# EAGLE design DSKY_DISP (EAGLE 7.4.0)
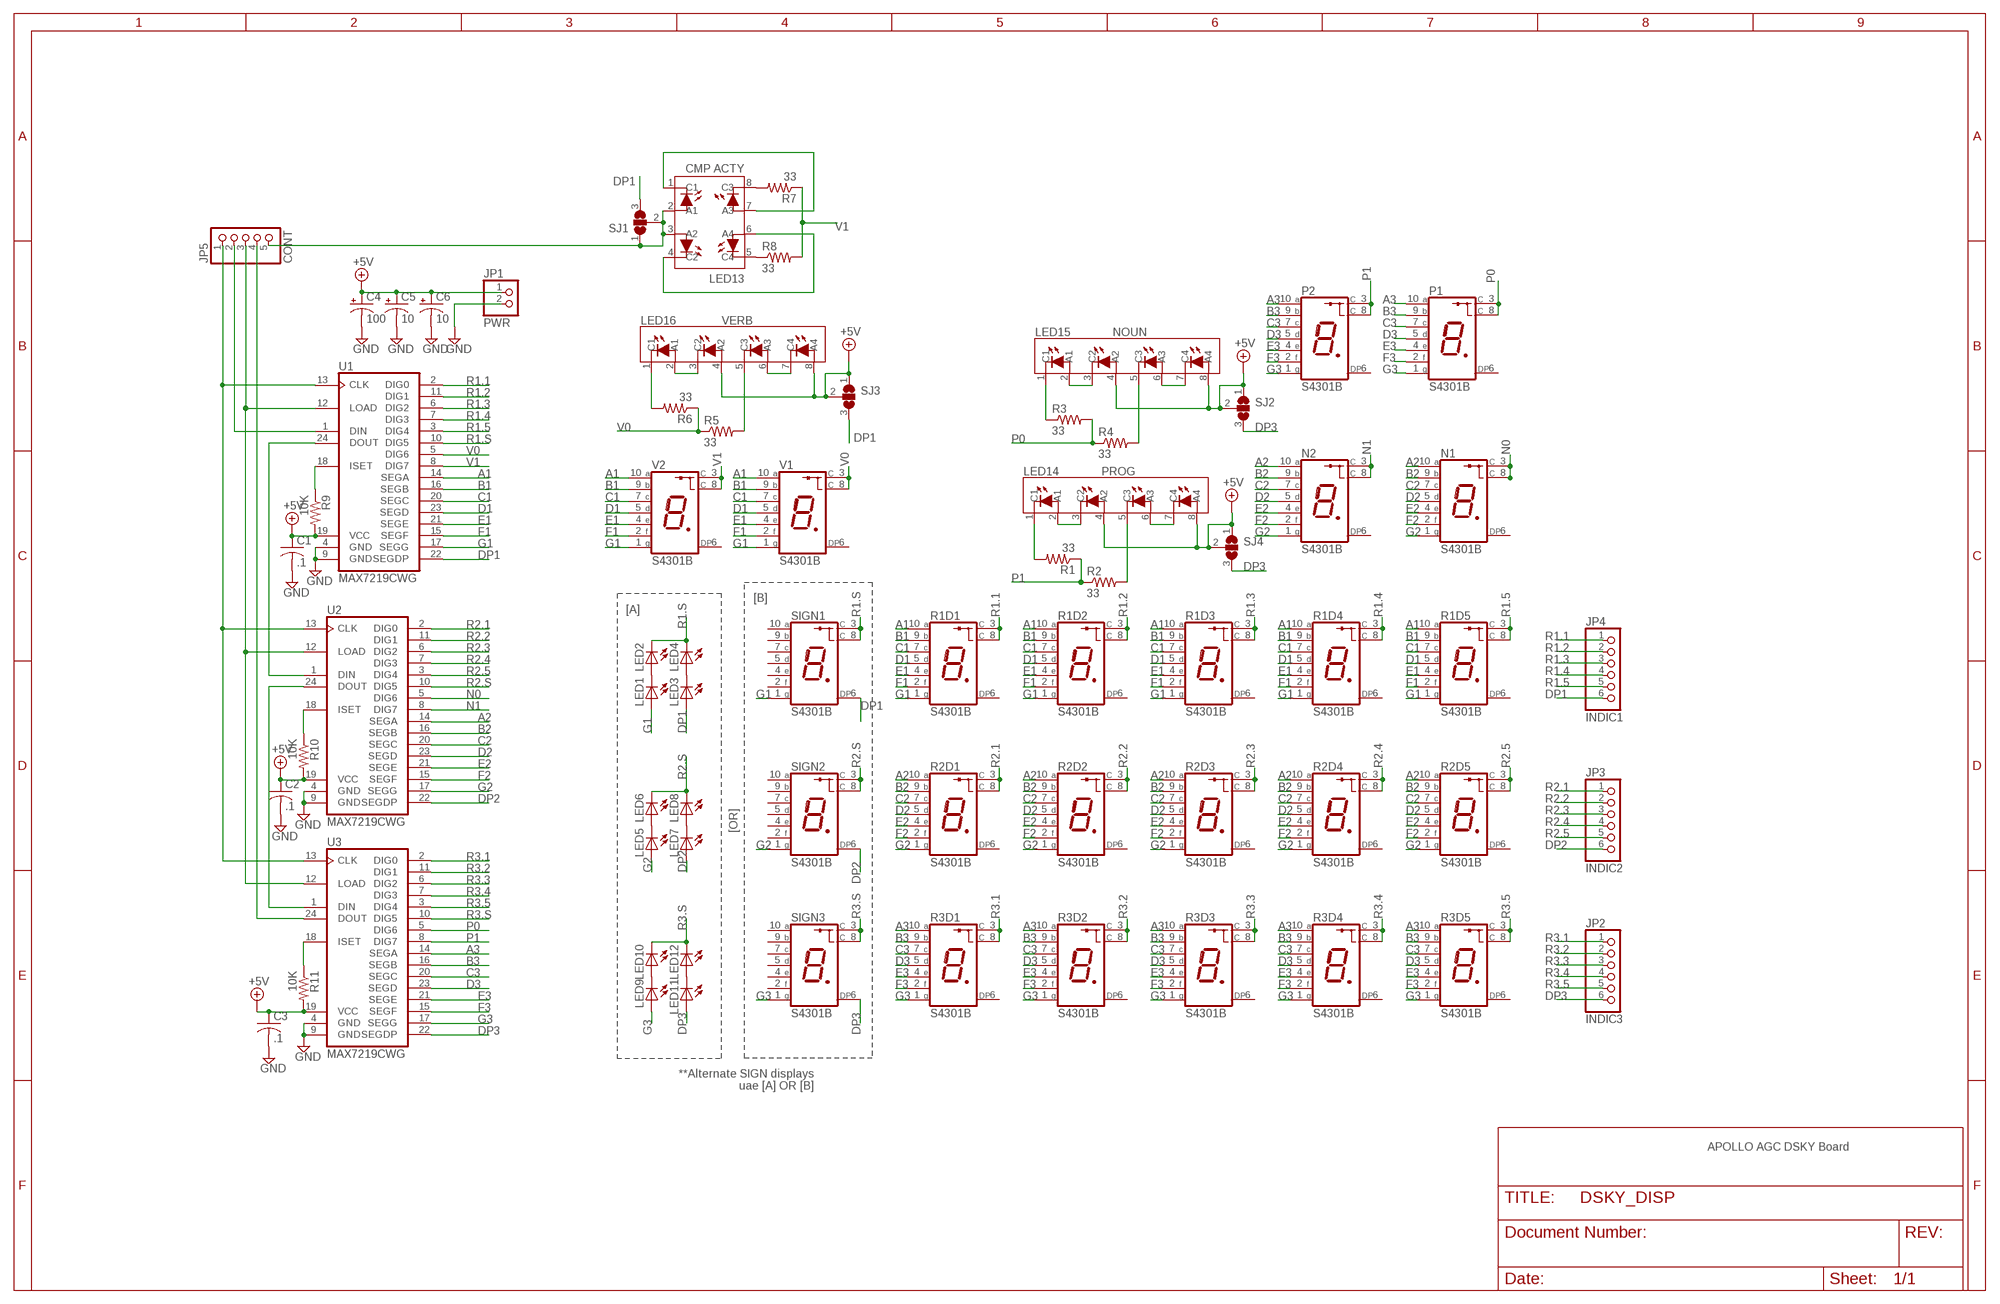
[diagram p0: schematic, sheet 1]

## Parts
C1  .1  C-US025-030X050  [C025-030X050]
C2  .1  C-US025-030X050  [C025-030X050]
C3  .1  C-US025-030X050  [C025-030X050]
C4  100  CPOL-USE2,5-6E  [E2,5-6E]
C5  10  CPOL-USE1.8-4  [E1,8-4]
C6  10  CPOL-USE1.8-4  [E1,8-4]
JP1  PWR  PINHD-1X2  [1X02]
JP2  INDIC3  PINHD-1X6  [1X06]
JP3  INDIC2  PINHD-1X6  [1X06]
JP4  INDIC1  PINHD-1X6  [1X06]
JP5  CONT  PINHD-1X5  [1X05]
LED1  LEDCHIPLED_0603  [CHIPLED_0603]
LED2  LEDCHIPLED_0603  [CHIPLED_0603]
LED3  LEDCHIPLED_0603  [CHIPLED_0603]
LED4  LEDCHIPLED_0603  [CHIPLED_0603]
LED5  LEDCHIPLED_0603  [CHIPLED_0603]
LED6  LEDCHIPLED_0603  [CHIPLED_0603]
LED7  LEDCHIPLED_0603  [CHIPLED_0603]
LED8  LEDCHIPLED_0603  [CHIPLED_0603]
LED9  LEDCHIPLED_0603  [CHIPLED_0603]
LED10  LEDCHIPLED_0603  [CHIPLED_0603]
LED11  LEDCHIPLED_0603  [CHIPLED_0603]
LED12  LEDCHIPLED_0603  [CHIPLED_0603]
LED13  CMP ACTY  HCLP-HLMP-2855  [SOCKET-08]
LED14  PROG  HLMP-2655  [SIP-08]
LED15  NOUN  HLMP-2655  [SIP-08]
LED16  VERB  HLMP-2655  [SIP-08]
N1  S4301B  [S4301B]
N2  S4301B  [S4301B]
P1  S4301B  [S4301B]
P2  S4301B  [S4301B]
R1  33  R-US_0207/10  [0207/10]
R1D1  S4301B  [S4301B]
R1D2  S4301B  [S4301B]
R1D3  S4301B  [S4301B]
R1D4  S4301B  [S4301B]
R1D5  S4301B  [S4301B]
R2  33  R-US_0207/10  [0207/10]
R2D1  S4301B  [S4301B]
R2D2  S4301B  [S4301B]
R2D3  S4301B  [S4301B]
R2D4  S4301B  [S4301B]
R2D5  S4301B  [S4301B]
R3  33  R-US_0207/10  [0207/10]
R3D1  S4301B  [S4301B]
R3D2  S4301B  [S4301B]
R3D3  S4301B  [S4301B]
R3D4  S4301B  [S4301B]
R3D5  S4301B  [S4301B]
R4  33  R-US_0207/10  [0207/10]
R5  33  R-US_0207/10  [0207/10]
R6  33  R-US_0207/10  [0207/10]
R7  33  R-US_0207/10  [0207/10]
R8  33  R-US_0207/10  [0207/10]
R9  10K  R-US_0207/10  [0207/10]
R10  10K  R-US_0207/10  [0207/10]
R11  10K  R-US_0207/10  [0207/10]
SIGN1  S4301B  [S4301B]
SIGN2  S4301B  [S4301B]
SIGN3  S4301B  [S4301B]
SJ1  SJ2WW  [SJ_2W]
SJ2  SJ2WW  [SJ_2W]
SJ3  SJ2WW  [SJ_2W]
SJ4  SJ2WW  [SJ_2W]
U1  MAX7219CWG  [SO24W]
U2  MAX7219CWG  [SO24W]
U3  MAX7219CWG  [SO24W]
V1  S4301B  [S4301B]
V2  S4301B  [S4301B]

## Nets
+5V: C1.1 C2.1 C3.1 C4.+ C5.+ C6.+ JP1.1 LED14.4(A2) LED14.8(A4) LED15.4(A2) LED15.8(A4) LED16.4(A2) LED16.8(A4) R9.2 R10.2 R11.2 SJ2.1 SJ2.2 SJ3.1 SJ3.2 SJ4.1 SJ4.2 U1.19(VCC) U2.19(VCC) U3.19(VCC)
A1: R1D1.10(A) R1D2.10(A) R1D3.10(A) R1D4.10(A) R1D5.10(A) U1.14(SEGA) V1.10(A) V2.10(A)
A2: N1.10(A) N2.10(A) R2D1.10(A) R2D2.10(A) R2D3.10(A) R2D4.10(A) R2D5.10(A) U2.14(SEGA)
A3: P1.10(A) P2.10(A) R3D1.10(A) R3D2.10(A) R3D3.10(A) R3D4.10(A) R3D5.10(A) U3.14(SEGA)
B1: R1D1.9(B) R1D2.9(B) R1D3.9(B) R1D4.9(B) R1D5.9(B) U1.16(SEGB) V1.9(B) V2.9(B)
B2: N1.9(B) N2.9(B) R2D1.9(B) R2D2.9(B) R2D3.9(B) R2D4.9(B) R2D5.9(B) U2.16(SEGB)
B3: P1.9(B) P2.9(B) R3D1.9(B) R3D2.9(B) R3D3.9(B) R3D4.9(B) R3D5.9(B) U3.16(SEGB)
C1: R1D1.7(C) R1D2.7(C) R1D3.7(C) R1D4.7(C) R1D5.7(C) U1.20(SEGC) V1.7(C) V2.7(C)
C2: N1.7(C) N2.7(C) R2D1.7(C) R2D2.7(C) R2D3.7(C) R2D4.7(C) R2D5.7(C) U2.20(SEGC)
C3: P1.7(C) P2.7(C) R3D1.7(C) R3D2.7(C) R3D3.7(C) R3D4.7(C) R3D5.7(C) U3.20(SEGC)
D1: R1D1.5(D) R1D2.5(D) R1D3.5(D) R1D4.5(D) R1D5.5(D) U1.23(SEGD) V1.5(D) V2.5(D)
D2: N1.5(D) N2.5(D) R2D1.5(D) R2D2.5(D) R2D3.5(D) R2D4.5(D) R2D5.5(D) U2.23(SEGD)
D3: P1.5(D) P2.5(D) R3D1.5(D) R3D2.5(D) R3D3.5(D) R3D4.5(D) R3D5.5(D) U3.23(SEGD)
DP1: JP4.6 LED3.A SIGN1.6(DP) SJ1.3 SJ3.3 U1.22(SEGDP)
DP2: JP3.6 LED7.A SIGN2.6(DP) U2.22(SEGDP)
DP3: JP2.6 LED11.A SIGN3.6(DP) SJ2.3 SJ4.3 U3.22(SEGDP)
E1: R1D1.4(E) R1D2.4(E) R1D3.4(E) R1D4.4(E) R1D5.4(E) U1.21(SEGE) V1.4(E) V2.4(E)
E2: N1.4(E) N2.4(E) R2D1.4(E) R2D2.4(E) R2D3.4(E) R2D4.4(E) R2D5.4(E) U2.21(SEGE)
E3: P1.4(E) P2.4(E) R3D1.4(E) R3D2.4(E) R3D3.4(E) R3D4.4(E) R3D5.4(E) U3.21(SEGE)
F1: R1D1.2(F) R1D2.2(F) R1D3.2(F) R1D4.2(F) R1D5.2(F) U1.15(SEGF) V1.2(F) V2.2(F)
F2: N1.2(F) N2.2(F) R2D1.2(F) R2D2.2(F) R2D3.2(F) R2D4.2(F) R2D5.2(F) U2.15(SEGF)
F3: P1.2(F) P2.2(F) R3D1.2(F) R3D2.2(F) R3D3.2(F) R3D4.2(F) R3D5.2(F) U3.15(SEGF)
G1: LED1.A R1D1.1(G) R1D2.1(G) R1D3.1(G) R1D4.1(G) R1D5.1(G) SIGN1.1(G) U1.17(SEGG) V1.1(G) V2.1(G)
G2: LED5.A N1.1(G) N2.1(G) R2D1.1(G) R2D2.1(G) R2D3.1(G) R2D4.1(G) R2D5.1(G) SIGN2.1(G) U2.17(SEGG)
G3: LED9.A P1.1(G) P2.1(G) R3D1.1(G) R3D2.1(G) R3D3.1(G) R3D4.1(G) R3D5.1(G) SIGN3.1(G) U3.17(SEGG)
GND: C1.2 C2.2 C3.2 C4.- C5.- C6.- JP1.2 U1.4(GND) U1.9(GND) U2.4(GND) U2.9(GND) U3.4(GND) U3.9(GND)
N0: N1.3(C) N1.8(C) U2.5(DIG6)
N1: N2.3(C) N2.8(C) U2.8(DIG7)
N$1: LED1.C LED2.A
N$2: LED3.C LED4.A
N$3: LED5.C LED6.A
N$4: LED7.C LED8.A
N$5: LED11.C LED12.A
N$6: LED9.C LED10.A
N$7: LED14.6(A3) LED14.7(C4)
N$8: LED14.2(A1) LED14.3(C2)
N$9: LED15.6(A3) LED15.7(C4)
N$10: LED15.2(A1) LED15.3(C2)
N$11: LED16.6(A3) LED16.7(C4)
N$12: LED16.2(A1) LED16.3(C2)
N$14: LED13.1(C1) LED13.7(A3)
N$15: LED13.4(C2) LED13.6(A4)
N$16: LED14.1(C1) R1.2
N$17: LED14.5(C3) R2.2
N$18: LED13.8(C3) R7.2
N$19: LED15.1(C1) R3.1
N$20: LED15.5(C3) R4.2
N$21: LED13.5(C4) R8.1
N$22: LED16.5(C3) R5.2
N$23: LED16.1(C1) R6.2
N$24: JP5.2 U1.1(DIN)
N$25: U1.24(DOUT) U2.1(DIN)
N$27: U2.24(DOUT) U3.1(DIN)
N$28: JP5.3 U1.12(LOAD) U2.12(LOAD) U3.12(LOAD)
N$29: JP5.1 U1.13(CLK) U2.13(CLK) U3.13(CLK)
N$31: JP5.4 U3.24(DOUT)
N$34: R9.1 U1.18(ISET)
N$35: R10.1 U2.18(ISET)
N$36: R11.1 U3.18(ISET)
N$37: JP5.5 LED13.2(A1) LED13.3(A2) SJ1.1 SJ1.2
P0: P1.3(C) P1.8(C) R3.2 R4.1 U3.5(DIG6)
P1: P2.3(C) P2.8(C) R1.1 R2.1 U3.8(DIG7)
R1.1: JP4.1 R1D1.3(C) R1D1.8(C) U1.2(DIG0)
R1.2: JP4.2 R1D2.3(C) R1D2.8(C) U1.11(DIG1)
R1.3: JP4.3 R1D3.3(C) R1D3.8(C) U1.6(DIG2)
R1.4: JP4.4 R1D4.3(C) R1D4.8(C) U1.7(DIG3)
R1.5: JP4.5 R1D5.3(C) R1D5.8(C) U1.3(DIG4)
R1.S: LED2.C LED4.C SIGN1.3(C) SIGN1.8(C) U1.10(DIG5)
R2.1: JP3.1 R2D1.3(C) R2D1.8(C) U2.2(DIG0)
R2.2: JP3.2 R2D2.3(C) R2D2.8(C) U2.11(DIG1)
R2.3: JP3.3 R2D3.3(C) R2D3.8(C) U2.6(DIG2)
R2.4: JP3.4 R2D4.3(C) R2D4.8(C) U2.7(DIG3)
R2.5: JP3.5 R2D5.3(C) R2D5.8(C) U2.3(DIG4)
R2.S: LED6.C LED8.C SIGN2.3(C) SIGN2.8(C) U2.10(DIG5)
R3.1: JP2.1 R3D1.3(C) R3D1.8(C) U3.2(DIG0)
R3.2: JP2.2 R3D2.3(C) R3D2.8(C) U3.11(DIG1)
R3.3: JP2.3 R3D3.3(C) R3D3.8(C) U3.6(DIG2)
R3.4: JP2.4 R3D4.3(C) R3D4.8(C) U3.7(DIG3)
R3.5: JP2.5 R3D5.3(C) R3D5.8(C) U3.3(DIG4)
R3.S: LED10.C LED12.C SIGN3.3(C) SIGN3.8(C) U3.10(DIG5)
V0: R5.1 R6.1 U1.5(DIG6) V1.3(C) V1.8(C)
V1: R7.1 R8.2 U1.8(DIG7) V2.3(C) V2.8(C)
Unconnected: N1.6(DP) N2.6(DP) P1.6(DP) P2.6(DP) R1D1.6(DP) R1D2.6(DP) R1D3.6(DP) R1D4.6(DP) R1D5.6(DP) R2D1.6(DP) R2D2.6(DP) R2D3.6(DP) R2D4.6(DP) R2D5.6(DP) R3D1.6(DP) R3D2.6(DP) R3D3.6(DP) R3D4.6(DP) R3D5.6(DP) SIGN1.2(F) SIGN1.4(E) SIGN1.5(D) SIGN1.7(C) SIGN1.9(B) SIGN1.10(A) SIGN2.2(F) SIGN2.4(E) SIGN2.5(D) SIGN2.7(C) SIGN2.9(B) SIGN2.10(A) SIGN3.2(F) SIGN3.4(E) SIGN3.5(D) SIGN3.7(C) SIGN3.9(B) SIGN3.10(A) V1.6(DP) V2.6(DP)

## Notes on the sheet
- [B]
- [A]
- [OR]
- **Alternate SIGN displays
  uae [A] OR [B]
- APOLLO AGC DSKY Board

## Library data of the parts
C1-C3 = rcl:C-US: CAPACITOR, American symbol
C4-C6 = rcl:CPOL-US: POLARIZED CAPACITOR, American symbol
JP1 = pinhead:PINHD-1X2: PIN HEADER
JP2-JP4 = pinhead:PINHD-1X6: PIN HEADER
JP5 = pinhead:PINHD-1X5: PIN HEADER
LED1-LED12 = led:LED: LED OSRAM: - CHIPLED LG R971, LG N971, LY N971, LG Q971, LY Q971, LO R971, LY R971 LH N974, LH R974 LS Q976, LO Q976, LY Q976 LO Q996 - Hyper CHIPLED LW Q18S LB Q993, LB Q99A, LB R99A - SideLED LS A670, LO A670, LY A670, LG A670, LP A670 LB A673, LV A673, LT A673, LW A673 LH A674 LY A675 LS A676, LA A676, LO A676, LY A676, LW A676 LS A679, LY A679, LG A679 - Hyper Micro SIDELED® LS Y876, LA Y876, LO Y876, LY Y876 LT Y87S - SmartLED LW L88C, LW L88S LB L89C, LB L89S, LG L890 LS L89K, LO L89K, LY L89K LS L896, LA L896, LO L896, LY L896 - TOPLED LS T670, LO T670, LY T670, LG T670, LP T670 LSG T670, LSP T670, LSY T670, LOP T670, LYG T670 LG T671, LOG T671, LSG T671 LB T673, LV T673, LT T673, LW T673 LH T674 LS T676, LA T676, LO T676, LY T676, LB T676, LH T676, LSB T676, LW T676 LB T67C, LV T67C, LT T67C, LS T67K, LO T67K, LY T67K, LW E67C LS E67B, LA E67B, LO E67B, LY E67B, LB E67C, LV E67C, LT E67C LW T67C LS T679, LY T679, LG T679 LS T770, LO T770, LY T770, LG T770, LP T770 LB T773, LV T773, LT T773, LW T773 LH T774 LS E675, LA E675, LY E675, LS T675 LS T776, LA T776, LO T776, LY T776, LB T776 LHGB T686 LT T68C, LB T68C - Hyper Mini TOPLED® LB M676 - Mini TOPLED Santana® LG M470 LS M47K, LO M47K, LY M47K Source: http://www.osram.convergy.de LUXEON: - LUMILED® LXK2-PW12-R00, LXK2-PW12-S00, LXK2-PW14-U00, LXK2-PW14-V00 LXK2-PM12-R00, LXK2-PM12-S00, LXK2-PM14-U00 LXK2-PE12-Q00, LXK2-PE12-R00, LXK2-PE12-S00, LXK2-PE14-T00, LXK2-PE14-U00 LXK2-PB12-K00, LXK2-PB12-L00, LXK2-PB12-M00, LXK2-PB14-N00, LXK2-PB14-P00, LXK2-PB14-Q00 LXK2-PR12-L00, LXK2-PR12-M00, LXK2-PR14-Q00, LXK2-PR14-R00 LXK2-PD12-Q00, LXK2-PD12-R00, LXK2-PD12-S00 LXK2-PH12-R00, LXK2-PH12-S00 LXK2-PL12-P00, LXK2-PL12-Q00, LXK2-PL12-R00 Source: www.luxeon.com KINGBRIGHT: KA-3528ASYC Source: www.kingbright.com
LED13 = HLCP-C100:HCLP-: HLCP-X100 and HLMP-2XXX series LED Light Bars Description The HLCP-X100 and HLMP-2XXX series light bars are rectangular light sources designed for a variety of applications where a large bright source of light is required. These light bars are configured in singlein- line and dual-in-line packages that contain either single or segmented light emitting areas. The AlGaAs Red HLCP-X100 series LEDs use double heterojunction AlGaAs on a GaAs substrate. The HER HLMP-2300/2600 and Yellow HLMP-2400/2700 series LEDs have their p-n junctions diffused into a GaAsP epitaxial layer on a GaP substrate. The Green HLMP- 2500/2800 series LEDs use a liquid phase GaP epitaxial layer on a GaP substrate. The bicolor HLMP- 2900 series use a combination of HER/Yellow or HER/ Green LEDs.
LED14-LED16 = lightbar:HLMP-2655
N1 N2 P1 P2 R1D1-R1D5 R2D1-R2D5 R3D1-R3D5 SIGN1-SIGN3 V1 V2 = led-7-segment:S4301B: Single Digit Seven-Segment Display (cathode common) Source: LITEON .. S4301B.pdf
R1-R11 = resistor:R-US_: RESISTOR, American symbol
SJ1-SJ4 = jumper:SJ2W: SMD solder JUMPER
U1-U3 = maxim-5:MAX7219*: Serially Interfaced, 8-Digit LED Display Drivers

## Board
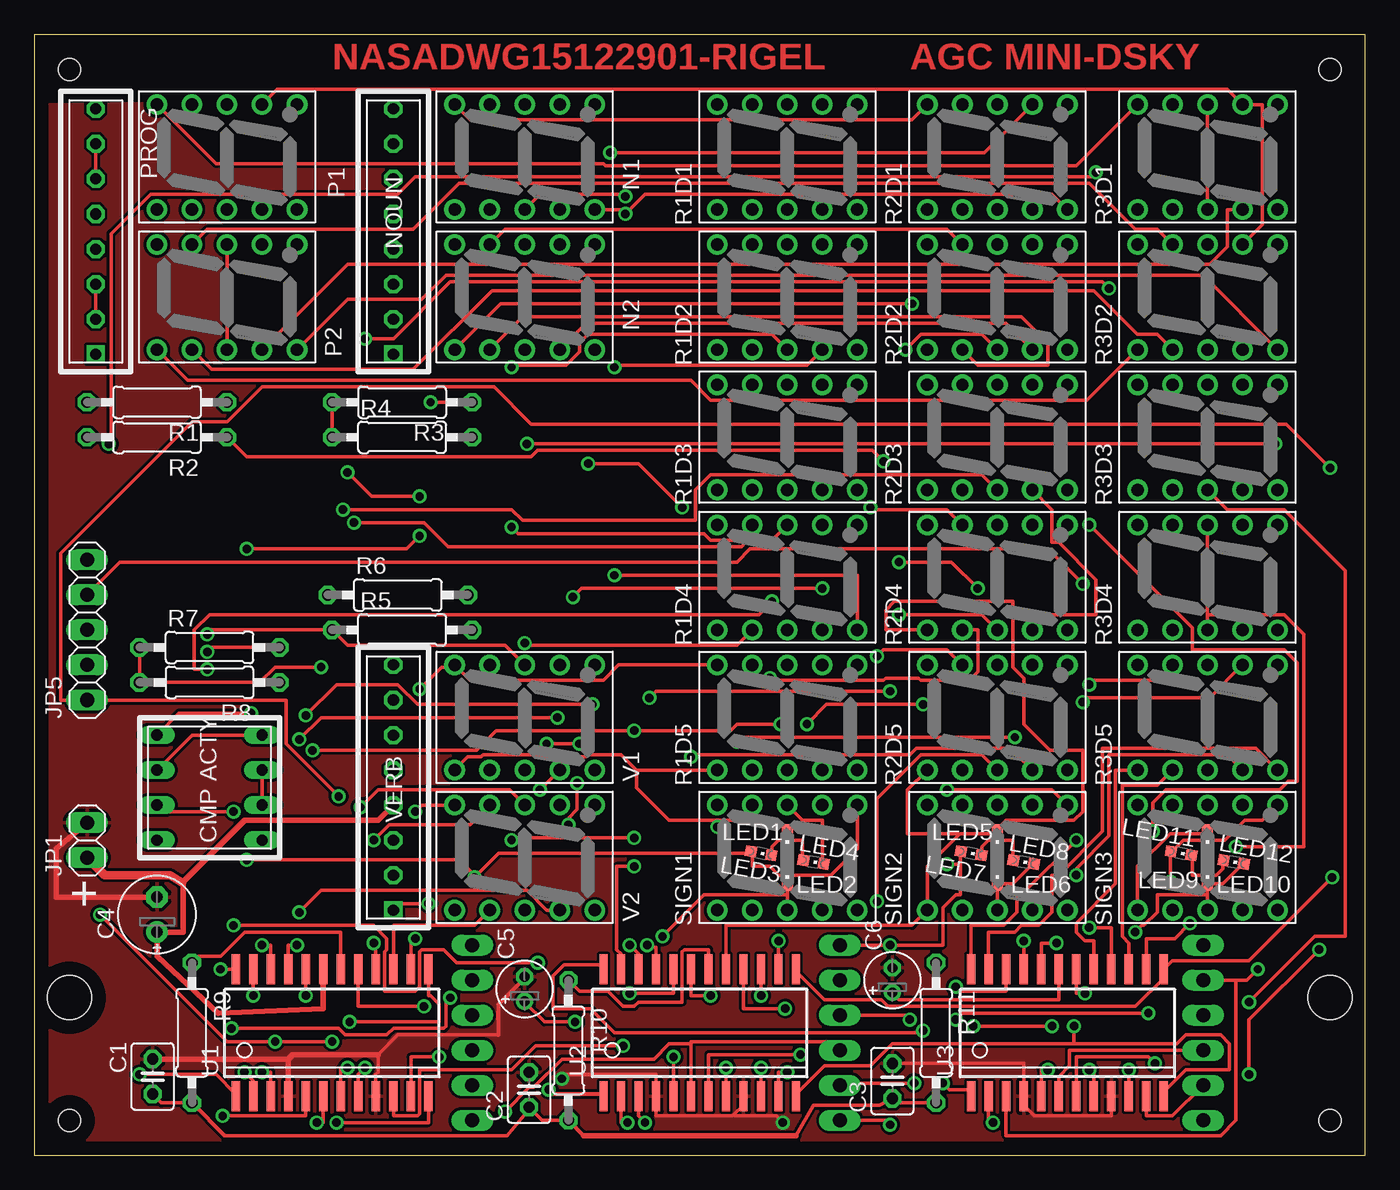
[diagram p1: board, top side]
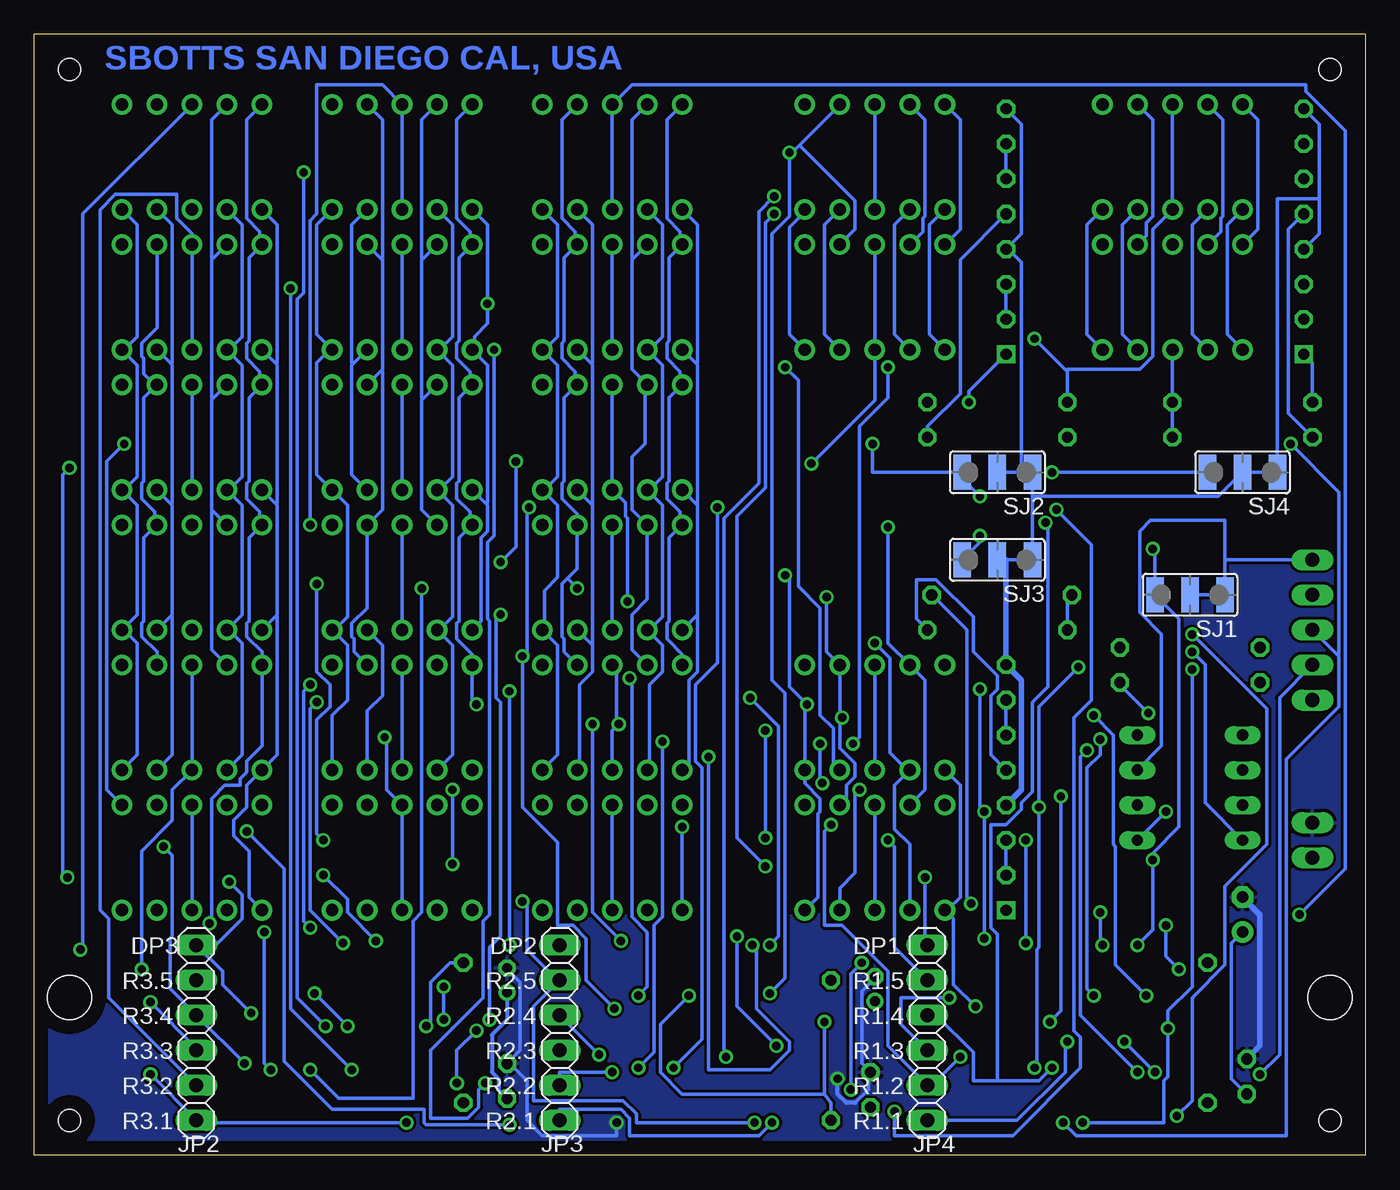
[diagram p2: board, bottom side, seen from below]

Size 96.52 x 81.28 mm. Coordinates in mm from the lower left corner, seen from the top.
Outline: 0,0 96.52,0 96.52,81.28 0,81.28 0,0
Copper layers (1*16): Top 0.035mm / dielectric 1.5mm / Bottom 0.035mm
Design rules "default": minimum track width 10mil, minimum drill 24mil, track to track 8mil, track to pad 8mil, pad to pad 8mil, via to via 8mil, smd to smd 8mil, copper to edge 40mil, drill to drill 8mil, minimum pad ring 10mil, minimum via ring 8mil, stop-mask expansion 4mil, vias tented up to drill 0mil, thermal gap 10mil
Holes 3.2 mm at 93.98,11.43 2.54,11.43
Holes 1.6 mm at 93.98,2.54 93.98,78.74 2.54,78.74 2.54,2.54

### Footprints (pad centres in the part's own frame; a part is rotated, then mirrored left to right if it is on the bottom)
C025-030X050 = drill 0.813 octagon: 1 -1.27,0; 2 1.27,0
E2,5-6E = drill 0.813 pad 1.575: + -1.27,0 | drill 0.813 pad 1.575 octagon: - 1.27,0
E1,8-4 = drill 0.711 pad 1.168: + -0.889,0 | drill 0.711 pad 1.168 octagon: - 0.889,0
1X02 = drill 1.016 long: 1 -1.27,0; 2 1.27,0
1X06 = drill 1.016 long: 1 -6.35,0; 2 -3.81,0; 3 -1.27,0; 4 1.27,0; 5 3.81,0; 6 6.35,0
1X05 = drill 1.016 long: 1 -5.08,0; 2 -2.54,0; 3 0,0; 4 2.54,0; 5 5.08,0
CHIPLED_0603 = smd 0.8 x 0.8: A 0,-0.75; C 0,0.75
SOCKET-08 = drill 0.813 long: 1 -3.81,-3.81; 2 -1.27,-3.81; 3 1.27,-3.81; 4 3.81,-3.81; 5 3.81,3.81; 6 1.27,3.81; 7 -1.27,3.81; 8 -3.81,3.81
SIP-08 = drill 0.8 square: 1 -8.89,0 | drill 0.8 octagon: 2 -6.35,0; 3 -3.81,0; 4 -1.27,0; 5 1.27,0; 6 3.81,0; 7 6.35,0; 8 8.89,0
S4301B = drill 0.9 pad 1.5: 1 -3.81,5.08; 2 -3.81,2.54; 3 -3.81,0; 4 -3.81,-2.54; 5 -3.81,-5.08; 6 3.81,-5.08; 7 3.81,-2.54; 8 3.81,0; 9 3.81,2.54; 10 3.81,5.08
0207/10 = drill 0.813 octagon: 1 -5.08,0; 2 5.08,0
SJ_2W = smd 1.27 x 2.54: 1 -2.54,0; 2 0,0; 3 2.54,0
SO24W = smd 0.6 x 2.2: 1 -6.985,-4.6; 2 -5.715,-4.6; 3 -4.445,-4.6; 4 -3.175,-4.6; 5 -1.905,-4.6; 6 -0.635,-4.6; 7 0.635,-4.6; 8 1.905,-4.6; 9 3.175,-4.6; 10 4.445,-4.6; 11 5.715,-4.6; 12 6.985,-4.6; 13 6.985,4.6; 14 5.715,4.6; 15 4.445,4.6; 16 3.175,4.6; 17 1.905,4.6; 18 0.635,4.6; 19 -0.635,4.6; 20 -1.905,4.6; 21 -3.175,4.6; 22 -4.445,4.6; 23 -5.715,4.6; 24 -6.985,4.6

### Placement (x,y rotation side)
C1  8.57,5.71 90 top
C2  35.88,4.76 90 top
C3  62.23,5.4 90 top
C4  8.89,17.46 90 top
C5  35.56,12.06 90 top
C6  62.23,12.7 90 top
JP1  3.81,22.86 90 top
JP2  84.77,8.89 90 bottom
JP3  58.42,8.89 90 bottom
JP4  31.75,8.89 90 bottom
JP5  3.81,38.1 90 top
LED1  54.61,22.86 180 top
LED2  54.61,20.32 180 top
LED3  52.7,21.91 260 top
LED4  56.52,21.27 260 top
LED5  69.85,22.86 180 top
LED6  69.85,20.32 180 top
LED7  67.94,21.91 260 top
LED8  71.75,21.27 260 top
LED9  85.09,22.86 180 top
LED10  85.09,20.32 180 top
LED11  83.19,21.91 260 top
LED12  87,21.27 260 top
LED13  12.7,26.67 90 top
LED14  4.45,66.99 90 top
LED15  26.04,66.99 90 top
LED16  26.04,26.67 90 top
N1  35.56,72.39 90 top
N2  35.56,62.23 90 top
P1  13.97,72.39 90 top
P2  13.97,62.23 90 top
R1  8.89,54.61 180 top
R1D1  54.61,72.39 90 top
R1D2  54.61,62.23 90 top
R1D3  54.61,52.07 90 top
R1D4  54.61,41.91 90 top
R1D5  54.61,31.75 90 top
R2  8.89,52.07 180 top
R2D1  69.85,72.39 90 top
R2D2  69.85,62.23 90 top
R2D3  69.85,52.07 90 top
R2D4  69.85,41.91 90 top
R2D5  69.85,31.75 90 top
R3  26.67,54.61 180 top
R3D1  85.09,72.39 90 top
R3D2  85.09,62.23 90 top
R3D3  85.09,52.07 90 top
R3D4  85.09,41.91 90 top
R3D5  85.09,31.75 90 top
R4  26.67,52.07 0 top
R5  26.67,38.1 0 top
R6  26.35,40.64 0 top
R7  12.7,36.83 0 top
R8  12.7,34.29 180 top
R9  11.43,8.89 270 top
R10  38.73,7.62 270 top
R11  65.41,8.89 270 top
SIGN1  54.61,21.59 90 top
SIGN2  69.85,21.59 90 top
SIGN3  85.09,21.59 90 top
SJ1  12.7,40.64 180 bottom
SJ2  26.67,49.53 180 bottom
SJ3  26.67,43.18 180 bottom
SJ4  8.89,49.53 180 bottom
U1  21.59,8.89 0 top
U2  48.26,8.89 0 top
U3  74.93,8.89 0 top
V1  35.56,31.75 90 top
V2  35.56,21.59 90 top

### Tracks (layer width: path | path; a pad name or v marks a point on that pad's centre or on a via)
+5V  (via drill 0.61)
  Top 0.254: R11.2 62.55,3.81 C3.1 61.28,3.65 56.52,3.65 55.24,1.43 | U3.19 74.3,11.27 62.71,11.27 62.23,11.75 C6.+ | U2.19 47.62,11.59 v49.05,11.59 | v39.21,9.68 36.99,9.68 35.56,11.11 C5.+ | R10.2 36.83,2.54 C2.1 35.88,3.33 34.29,1.43 13.81,1.43 | C1.1 9.21,3.81 R9.2 | 10.79,19.68 10.72,19.76
  Top 0.305: R10.2 39.85,1.43 | R9.2 13.81,1.43
  Top 0.406: 39.85,1.43 55.24,1.43 | U1.19 20.95,10.64 13.34,10.32 8.89,14.45 C4.+ 10.79,16.19 10.79,19.68 | 10.72,19.76 15.24,24.29 24.92,24.29 LED16.4
  Top 0.61: JP1.1 5.08,20.32 9.84,20.32 10.72,19.76
  Bottom 0.254: v49.05,11.59 51.12,9.53 51.12,6.03 49.53,4.45 39.21,4.45 | 39.21,4.45 38.73,3.81 R10.2 | 39.21,4.45 v39.21,9.68 | C1.1 9.68,5.56 9.68,15.4 C4.+ | LED15.8 24.92,74.77 24.92,66.83 LED15.4 25.88,65.72 24.92,64.77 24.92,49.53 | LED14.4 3.33,66.83 3.33,69.37 | 3.33,69.37 3.33,74.77 LED14.8 | SJ3.2 26.04,43.18 SJ3.1 24.13,47.78 | SJ2.2 24.92,49.53 | 24.92,49.53 SJ2.1 24.13,47.78 | 24.13,47.78 10.64,47.78 SJ4.2 SJ4.1 6.35,69.37 3.33,69.37
  Bottom 0.305: C3.1 62.87,4.76 62.87,5.56 63.34,6.03 63.34,8.73 62.23,9.84 C6.+
  Bottom 0.406: LED16.4 24.92,26.51 24.92,34.45 LED16.8 26.04,43.18
A1  (via drill 0.61)
  Top 0.254: U1.14 27.3,15.72 v27.62,15.72 | v27.62,24.92 28.1,25.4 V2.10 | R1D5.10 42.39,35.56 41.27,34.45 31.59,34.45 V1.10 30.48,35.4 29.53,35.4 v27.94,33.81
  Bottom 0.254: v27.62,15.72 v27.62,24.92 27.94,25.24 v27.94,33.81 | R1D5.10 49.53,36.35 50.64,37.47 50.64,38.58 50.48,38.73 50.48,44.77 R1D4.10 49.69,45.72 49.69,46.67 50.64,47.62 50.64,48.74 50.48,48.9 50.48,54.93 R1D3.10 49.69,55.88 49.69,56.83 50.64,57.78 50.64,58.9 50.48,59.05 50.48,65.09 R1D2.10 49.69,66.04 49.69,66.99 50.64,67.94 50.64,75.09 R1D1.10
A2  (via drill 0.61)
  Top 0.254: v53.98,15.56 U2.14 | v56.04,31.27 57.47,32.7 v64.45,32.7 | N1.10 31.59,75.09 63.66,75.09 R2D1.10
  Bottom 0.254: N2.10 29.37,67.15 29.37,75.09 N1.10 | v53.98,15.56 56.04,17.62 v56.04,31.27 | v64.45,32.7 64.77,33.02 R2D5.10 64.77,36.35 65.88,37.47 65.88,38.58 65.72,38.73 65.72,44.77 R2D4.10 64.93,45.72 64.93,46.67 65.88,47.62 65.88,48.74 65.72,48.9 65.72,54.93 R2D3.10 64.93,55.88 64.93,56.83 65.88,57.78 65.88,58.9 65.72,59.05 65.72,65.09 R2D2.10 64.93,66.04 64.93,66.99 65.88,67.94 65.88,75.09 R2D1.10
A3  (via drill 0.61)
  Top 0.254: U3.14 80.64,15.72 82.71,15.72 v83.82,16.83 | P1.10 13.18,71.91 41.27,71.91 41.43,71.75 75.56,71.75 R3D1.10
  Bottom 0.254: P2.10 7.78,67.15 7.78,75.09 P1.10 | v83.82,16.83 83.66,16.99 83.66,25.88 82.71,26.83 81.6,26.83 81.6,27.3 81.12,27.78 81.12,28.57 80.01,29.69 R3D5.10 80.01,36.51 81.12,37.62 81.12,38.58 80.96,38.73 80.96,44.77 R3D4.10 80.17,45.72 80.17,46.67 81.12,47.62 81.12,48.74 80.96,48.9 80.96,54.93 R3D3.10 80.17,55.88 80.17,56.83 81.12,57.78 81.12,58.9 80.96,59.05 80.96,65.09 R3D2.10 80.17,66.04 80.17,66.99 81.12,67.94 81.12,75.09 R3D1.10
B1  (via drill 0.61)
  Top 0.254: U1.16 24.77,15.4 v24.61,15.4 | v24.61,22.86 25.72,23.97 31.59,23.97 V2.9 | v34.61,45.56 35.08,45.09 48.58,45.09 49.05,44.61 50.96,44.61 R1D4.9
  Bottom 0.254: v24.61,22.86 v24.61,15.4 | V2.9 31.91,26.51 31.91,34.45 V1.9 34.61,37.15 v34.61,45.56 | R1D5.9 53.18,36.67 53.18,39.21 52.07,40.32 R1D4.9 53.18,46.83 53.18,50.64 52.23,51.59 52.23,55.88 R1D3.9 53.18,56.99 53.18,64.93 53.1,65.01 | R1D2.9 53.1,65.01 | R1D1.9 53.18,75.09 53.18,65.09 53.1,65.01
B2  (via drill 0.61)
  Top 0.254: U2.16 51.44,10.64 v54.45,10.64 | v61.12,36.2 61.59,36.67 66.2,36.67 R2D5.9 | N2.9 34.13,67.15 66.2,67.15 R2D2.9 | v60.64,46.99 60.8,46.83 66.2,46.83 R2D4.9
  Bottom 0.254: v54.45,10.64 56.52,12.7 56.52,15.72 57.47,16.67 58.58,16.67 58.58,22.7 61.12,25.24 v61.12,36.2 60.8,36.51 60.8,46.83 v60.64,46.99 | N2.9 32.07,66.99 32.07,67.94 31.91,68.1 31.91,75.09 N1.9 | R2D4.9 68.42,46.83 68.42,54.77 68.34,54.85 | R2D3.9 68.34,54.85 | 68.34,65.01 68.42,64.93 68.42,54.93 68.34,54.85 | 68.34,65.01 R2D2.9 | R2D1.9 68.42,75.09 68.42,65.09 68.34,65.01
B3  (via drill 0.61)
  Top 0.254: U3.16 78.11,16.51 v76.52,16.51 | v76.52,34.13 76.83,34.45 81.44,34.45 R3D5.9 | P2.9 12.54,67.15 27.46,67.15 30.8,70.48 76.52,70.48 79.85,67.15 81.44,67.15 R3D2.9
  Bottom 0.254: v76.52,16.51 76.99,16.99 76.99,33.66 v76.52,34.13 | P2.9 10.48,66.99 10.48,67.94 10.32,68.1 10.32,75.09 P1.9 | 83.58,46.75 83.66,46.83 83.66,54.77 83.58,54.85 | 83.58,46.75 R3D4.9 | R3D3.9 83.58,54.85 | 83.58,65.01 83.66,64.93 83.66,54.93 83.58,54.85 | 83.58,65.01 R3D2.9 | R3D1.9 83.66,75.09 83.66,65.09 83.58,65.01 | R3D5.9 83.66,36.67 83.66,46.67 83.58,46.75
C1  (via drill 0.61)
  Top 0.254: v19.68,11.59 U1.20 | v19.21,30.16 20.8,31.75 v37.94,31.75 | v39.05,40.48 39.69,41.12 v57.15,41.12
  Bottom 0.254: v19.68,11.59 20.16,12.06 20.16,28.1 19.21,29.05 v19.21,30.16 | V2.7 37.62,25.88 37.62,26.83 36.99,27.46 36.99,28.42 38.1,29.53 38.1,31.75 v37.94,31.75 38.1,31.91 V1.7 39.05,36.51 v39.05,40.48 | R1D5.7 58.1,36.51 58.1,37.47 58.26,37.62 58.26,41.43 57.86,41.83 | 57.86,41.83 57.15,42.55 R1D4.7 57.15,46.51 58.26,47.62 58.26,48.74 58.1,48.9 58.1,54.93 R1D3.7 57.31,55.88 57.31,56.83 58.26,57.78 58.26,58.9 58.1,59.05 58.1,65.09 R1D2.7 57.31,66.04 57.31,66.99 58.26,67.94 58.26,75.09 R1D1.7 | 57.86,41.83 v57.15,41.12
C2  (via drill 0.61)
  Top 0.254: U2.20 46.35,11.75 v43.18,11.75 | R2D1.7 68.9,72.71 v41.75,72.71
  Bottom 0.254: R2D5.7 73.34,36.51 73.34,37.47 73.5,37.62 73.5,38.58 72.39,39.69 R2D4.7 71.28,46.83 71.28,56.83 71.36,56.91 | 71.36,56.91 71.28,56.99 71.28,64.93 71.36,65.01 | 71.36,56.91 R2D3.7 | R2D2.7 71.36,65.01 | R2D1.7 71.28,75.09 71.28,65.09 71.36,65.01 | v43.18,11.75 42.07,12.86 42.07,33.5 43.02,34.45 43.02,66.83 41.75,68.1 41.75,72.55 41.67,72.63 | N1.7 41.04,73.26 | 41.04,73.26 41.67,72.63 | N2.7 36.99,67.15 36.99,69.22 41.04,73.26 | v41.75,72.71 41.67,72.63
C3  (via drill 0.61)
  Top 0.254: U3.20 73.03,15.4 v74.14,15.4 | v76.04,32.86 76.36,33.18 85.25,33.18 R3D5.7 | R3D2.7 89.06,67.47 89.06,76.2 R3D1.7 86.52,77.31 17.62,77.31 P1.7
  Bottom 0.254: v74.14,15.4 76.52,17.78 76.52,32.38 v76.04,32.86 | R3D5.7 87.63,36.51 88.74,37.62 88.74,38.58 88.58,38.73 88.58,44.77 R3D4.7 87.79,45.72 87.79,46.67 88.74,47.62 88.74,48.74 88.58,48.9 88.58,54.93 R3D3.7 87.79,55.88 88.58,56.67 88.58,57.78 88.74,57.94 88.74,58.9 87.63,60.01 R3D2.7 | P2.7 15.88,66.67 15.88,67.63 15.4,68.1 15.4,75.09 P1.7
D1  (via drill 0.61)
  Top 0.254: v15.88,11.59 U1.23 | v19.68,31.91 21.91,34.13 26.35,34.13 27.78,32.7 v40.48,32.7 | R1D4.5 59.69,42.07 v42.07,42.07
  Bottom 0.254: R1D5.5 58.58,29.05 58.58,36.99 R1D4.5 59.53,38.1 59.53,40.96 58.58,41.91 58.58,47.15 R1D3.5 59.53,48.26 58.58,49.21 58.58,57.31 R1D2.5 59.53,58.42 58.58,59.37 58.58,67.47 R1D1.5 | v15.88,11.59 18.1,13.81 18.1,22.38 18.26,22.54 18.26,30.48 v19.68,31.91 | V2.5 39.69,18.73 39.69,24.77 39.53,24.92 39.53,25.88 40.64,26.99 V1.5 40.64,32.54 v40.48,32.7 40.64,32.7 40.64,32.86 41.75,33.97 41.75,41.75 v42.07,42.07
D2  (via drill 0.61)
  Top 0.254: U2.23 42.55,14.61 42.23,14.92 42.23,20.95 v43.5,20.95 | N1.5 42.55,68.58 v42.86,68.26 42.86,68.42 43.02,68.42 44.29,69.69 73.82,69.69 R2D1.5
  Bottom 0.254: R2D1.5 76.04,67.47 76.04,59.53 R2D2.5 75.09,58.42 76.04,57.47 76.04,49.37 R2D3.5 73.82,47.15 73.82,39.05 74.77,38.1 R2D4.5 73.82,36.99 73.82,33.02 74.93,31.91 R2D5.5 | v43.5,20.95 45.56,23.02 45.56,46.35 43.5,48.42 43.5,67.63 v42.86,68.26 | N2.5 41.75,59.53 41.75,67.31 40.64,68.42 N1.5
D3
  Top 0.254: U3.23 69.22,16.19 71.12,16.19 71.6,16.67 72.87,16.67 73.82,17.62 73.82,20.32 74.3,20.32 77.47,23.5 77.47,29.53 88.58,29.53 R3D5.5 | P2.5 22.7,62.07 28.1,62.07 29.84,63.82 84.77,63.82 R3D2.5
  Bottom 0.254: P2.5 20.16,59.53 20.16,67.47 P1.5 | R3D1.5 89.06,67.47 89.06,59.37 90.01,58.42 R3D2.5 89.06,57.31 89.06,49.21 90.01,48.26 R3D3.5 89.06,47.15 89.06,39.21 R3D4.5 90.01,38.1 89.06,37.15 89.06,29.05 R3D5.5
DP1  (via drill 0.61)
  Top 0.254: SIGN1.6 59.69,22.23 57.78,20.32 53.98,20.32 53.34,20.95 52.07,20.95 52.07,21.91 LED3.A 51.91,21.91 33.66,21.91 v31.91,20.16 31.91,20.32 30.8,21.43 v15.4,21.43 | U1.22 17.14,15.24 v16.51,15.24 | v27.94,44.93 26.99,43.97 v15.4,43.97
  Bottom 0.254: JP4.6 31.91,15.4 v31.91,20.16 | v16.51,15.24 15.4,16.35 v15.4,21.43 15.4,21.91 13.49,23.81 13.49,38.89 SJ1.3 15.24,43.81 v15.4,43.97 | SJ3.3 27.94,44.45 v27.94,44.93
DP2  (via drill 0.61)
  Top 0.254: 67.15,21.11 67.15,18.89 66.83,18.89 65.88,17.94 65.88,15.24 v62.07,15.24 JP3.6 | 67.15,21.11 67.15,21.91 LED7.A | U2.22 43.81,14.61 v43.18,15.24 | v44.61,33.18 45.09,33.66 v62.07,33.66 | SIGN2.6 73.82,26.51 v66.2,26.51 | 67.15,21.11 v66.2,21.11
  Bottom 0.254: v43.18,15.24 42.55,15.88 42.55,31.11 v44.61,33.18 | v62.07,15.24 v62.07,33.66 | v66.2,21.11 v66.2,26.51
DP3  (via drill 0.61)
  Top 0.254: v22.7,49.53 24.45,47.78 v27.94,47.78 | SIGN3.6 89.06,24.29 87.79,24.29 86.36,22.86 83.34,22.86 82.55,22.07 LED11.A 82.39,21.91 v82.39,19.84 | U3.22 70.48,11.91 67.15,11.91 v66.83,12.22 | v66.83,9.84 67.31,10.32 v80.8,10.32 | v90.01,51.59 v35.72,51.59
  Bottom 0.254: v22.7,49.53 SJ4.3 | v27.94,47.78 29.21,49.05 SJ2.3 35.72,49.53 v35.72,51.59 | v66.83,9.84 v66.83,12.22 | v80.8,10.32 82.87,12.38 82.87,13.34 JP2.6 83.98,14.61 81.44,17.14 81.44,18.89 v82.39,19.84 | v90.01,51.59 91.28,50.32 91.28,26.51 SIGN3.6
E1  (via drill 0.61)
  Top 0.254: U1.21 18.41,15.24 v19.05,15.24 | v19.21,17.62 20.8,19.21 35.72,19.21 37.15,17.78 V2.4 | v36.67,26.51 V1.4 | v42.07,57.15 42.23,57.31 56.04,57.31 R1D2.4
  Bottom 0.254: v19.05,15.24 19.21,15.4 v19.21,17.62 | v36.67,26.51 36.99,26.19 36.99,20.48 38.1,19.37 V2.4 | R1D5.4 56.99,28.1 56.99,34.13 56.04,35.08 56.04,36.99 56.12,37.07 | R1D4.4 56.12,37.07 | 56.12,47.23 56.04,47.15 56.04,37.15 56.12,37.07 | 56.12,47.23 R1D3.4 | 56.12,57.39 56.04,57.31 56.04,47.31 56.12,47.23 | 56.12,57.39 R1D2.4 | R1D1.4 56.04,67.47 56.04,57.47 56.12,57.39 | V1.4 38.58,28.42 38.58,30.96 39.53,31.91 39.53,39.69 41.12,41.27 41.12,56.2 v42.07,57.15
E2  (via drill 0.61)
  Top 0.254: N2.4 40.01,60.33 70.48,60.33 R2D2.4 | U2.21 45.09,15.08 44.61,15.08 v44.45,15.24 | v47.62,28.89 47.78,29.05 63.5,29.05 63.98,29.53 70.8,29.53 R2D5.4 | R2D3.4 73.82,46.83 73.82,44.45 74.3,44.45 76.99,41.75 76.99,39.21 73.5,39.21 R2D4.4
  Bottom 0.254: N2.4 39.21,59.53 39.21,67.47 N1.4 | R2D3.4 73.5,49.37 73.5,57.31 73.42,57.39 | R2D2.4 73.42,57.39 | R2D1.4 73.5,67.47 73.5,57.47 73.42,57.39 | v44.45,15.24 44.13,14.92 44.13,10.64 41.75,8.26 41.75,7.62 43.18,6.19 47.62,6.19 v47.62,28.89 | R2D4.4 71.28,36.99 71.28,33.34 72.39,32.23 R2D5.4
E3  (via drill 0.61)
  Top 0.254: v71.75,15.56 U3.21 | v75.56,20.32 75.56,20.8 77.95,23.18 77.95,29.05 86.52,29.05 R3D5.4 | P2.4 22.7,64.61 85.25,64.61 86.52,65.88 86.52,68.58 R3D1.4
  Bottom 0.254: v71.75,15.56 73.82,17.62 73.82,18.57 v75.56,20.32 | P2.4 17.62,59.53 17.62,67.47 P1.4 | 86.6,39.13 86.52,39.21 86.52,47.15 86.6,47.23 | 86.6,39.13 R3D4.4 | R3D3.4 86.6,47.23 | 86.6,57.39 86.52,57.31 86.52,47.31 86.6,47.23 | 86.6,57.39 R3D2.4 | R3D1.4 86.52,67.47 86.52,57.47 86.6,57.39 | R3D5.4 86.52,29.05 86.52,39.05 86.6,39.13
F1  (via drill 0.61)
  Top 0.254: U1.15 26.04,16.67 31.91,16.67 V2.2 | v35.56,37.15 35.72,36.99 50.96,36.99 R1D4.2
  Bottom 0.254: V2.2 33.02,22.54 34.13,23.65 34.13,26.83 V1.2 33.18,27.94 34.45,29.21 34.45,36.04 v35.56,37.15 | R1D5.2 51.91,28.1 51.91,34.13 50.96,35.08 50.96,36.99 R1D4.2 51.91,38.1 50.96,39.05 50.96,47.15 R1D3.2 51.91,48.26 50.96,49.21 50.96,57.31 R1D2.2 51.91,58.42 50.96,59.37 50.96,67.47 R1D1.2
F2  (via drill 0.61)
  Top 0.254: v52.7,11.59 U2.15 | v53.34,34.61 53.5,34.45 61.59,34.45 61.75,34.61 64.14,34.61 64.29,34.45 67.79,34.45 68.42,35.08 68.42,38.1 R2D4.2 | N2.2 35.4,60.8 71.6,60.8 73.5,58.9 73.5,57.31 68.42,57.31 R2D2.2
  Bottom 0.254: N2.2 34.13,59.53 34.13,67.47 N1.2 | v52.7,11.59 52.07,12.22 52.07,16.19 53.18,17.3 53.18,34.45 v53.34,34.61 | R2D5.2 66.2,29.05 66.2,36.99 R2D4.2 67.15,38.1 66.2,39.05 66.2,47.15 R2D3.2 67.15,48.26 66.2,49.21 66.2,57.31 R2D2.2 67.15,58.42 66.2,59.37 66.2,67.47 R2D1.2
F3
  Top 0.254: U3.15 79.38,15.4 78.9,15.88 78.9,26.83 81.44,26.83 R3D5.2 | P2.2 12.86,56.99 27.46,56.99 33.18,62.71 76.83,62.71 80.01,59.53 81.44,59.53 R3D2.2
  Bottom 0.254: P2.2 12.54,59.53 12.54,67.47 P1.2 | R3D1.2 81.44,67.47 81.44,59.37 82.39,58.42 R3D2.2 81.44,57.31 81.44,49.21 82.39,48.26 R3D3.2 81.44,47.15 81.44,39.21 R3D4.2 82.39,38.1 81.44,37.15 81.44,29.05 R3D5.2
G1  (via drill 0.61)
  Top 0.254: U1.17 23.5,10.79 v28.26,10.79 | 49.53,24.29 46.04,24.29 43.66,26.67 43.66,27.94 | 49.53,24.29 53.98,24.29 54.61,23.65 LED1.A | R1D5.1 43.66,27.94 | 49.53,24.29 v49.53,23.81 | V1.1 31.43,28.89 32.38,28.89 32.54,29.05 36.67,29.05 36.83,28.89 37.47,28.89 37.62,29.05 39.05,29.05 39.21,28.89 40.01,28.89 40.16,29.05 42.55,29.05 43.66,27.94
  Bottom 0.254: v28.26,10.79 29.84,12.38 29.84,17.14 V2.1 30.32,17.78 29.37,18.73 29.37,26.83 V1.1 | v49.53,23.81 SIGN1.1 | 48.5,39.13 48.42,39.21 48.42,47.15 48.5,47.23 | 48.5,39.13 R1D4.1 | R1D3.1 48.5,47.23 | 48.5,57.39 48.42,57.31 48.42,47.31 48.5,47.23 | 48.5,57.39 R1D2.1 | R1D1.1 48.42,67.47 48.42,57.47 48.5,57.39 | R1D5.1 49.05,28.42 49.05,34.45 48.42,35.08 48.42,39.05 48.5,39.13
G2  (via drill 0.61)
  Top 0.254: 67.07,23.26 64.77,20.95 SIGN2.1 63.66,16.67 50.16,16.67 U2.17 | 67.07,23.26 67.15,23.34 69.69,23.34 69.85,23.5 LED5.A 69.85,23.65 70.48,24.29 75.41,24.29 76.04,24.92 76.04,29.37 73.66,29.37 71.75,31.27 71.75,34.61 70.96,35.4 70.96,40.16 62.39,40.16 61.75,39.53 61.75,38.1 R2D4.1 | R2D5.1 63.34,26.51 63.34,23.34 66.99,23.34 67.07,23.26 | N2.1 33.81,61.75 v63.66,61.75
  Bottom 0.254: N2.1 31.59,59.53 31.59,67.47 N1.1 | R2D4.1 64.14,38.73 64.14,44.77 63.66,45.24 63.66,47.15 63.74,47.23 | R2D3.1 63.74,47.23 | 63.74,47.23 63.66,47.31 63.66,57.31 R2D2.1 64.61,58.42 64.61,59.37 63.66,60.33 v63.66,61.75 63.66,67.47 R2D1.1
G3
  Top 0.254: SIGN3.1 80.01,20.95 82.39,23.34 84.93,23.34 85.09,23.5 LED9.A | U3.17 76.83,15.56 76.2,15.56 75.56,16.19 75.56,16.83 78.42,19.68 78.42,27.94 R3D5.1 | P2.1 11.11,56.2 47.62,56.2 49.05,54.77 76.36,54.77 R3D2.1
  Bottom 0.254: SIGN3.1 80.96,18.73 80.96,22.07 82.07,23.18 82.07,24.29 81.12,25.24 81.12,26.83 R3D5.1 78.9,29.05 78.9,39.05 78.98,39.13 | P2.1 10,59.53 10,67.47 P1.1 | 78.98,39.13 78.9,39.21 78.9,47.15 78.98,47.23 | 78.98,39.13 R3D4.1 | R3D3.1 78.98,47.23 | 78.98,57.39 78.9,57.31 78.9,47.31 78.98,47.23 | 78.98,57.39 R3D2.1 | R3D1.1 78.9,67.47 78.9,57.47 78.98,57.39
GND  (via drill 0.61)
  Top 0.254: C3.2 71.75,6.67 U3.4 71.75,3.65 72.55,2.86 78.11,2.86 U3.9 | 50.72,2.94 51.44,3.65 U2.9 | 50.72,2.94 50.64,2.86 45.09,2.86 U2.4 45.09,5.87 | U1.9 24.77,5.87 24.92,6.03 24.92,7.3 26.35,8.73 33.66,8.73 | 35.56,12.86 C5.- | v54.29,2.38 53.82,2.86 50.8,2.86 50.72,2.94
  Top 0.305: 45.09,5.87 38.58,5.87 v38.26,5.56 | 35.56,12.86 33.66,10.95 33.66,8.73
  Top 0.406: JP1.2 1.59,22.23 1.59,18.73 C4.- | 18.41,6.99 U1.4 | C1.2 18.41,6.99 | 24.92,7.3 18.73,7.3 18.41,6.99
  Bottom 0.254: C6.- 62.23,13.49 61.28,12.54 61.28,7.62 C3.2 62.07,6.67 60.8,5.4 60.8,2.54 59.69,1.43 54.29,1.43 v54.29,2.38 | C5.- 35.56,12.86 36.51,11.91 36.51,6.67 C2.2 36.04,6.03 36.04,4.76 36.99,3.81
  Bottom 0.305: v38.26,5.56 38.26,4.45 37.62,3.81 36.99,3.81
  Bottom 0.406: C4.- 7.62,17.46 7.62,7.94 C1.2
  pour Bottom: 0,0 96.52,0 96.52,77.47 0,77.47
  pour Top: 0,0 96.52,0 96.52,77.47 0,76.2
N0  (via drill 0.61)
  Top 0.254: v46.35,7.14 U2.5 | v42.86,69.53 42.7,69.69 36.67,69.69 N1.3
  Bottom 0.254: v46.35,7.14 46.51,7.3 46.51,46.2 43.97,48.74 43.97,68.42 v42.86,69.53 | N1.3 N1.8
N1  (via drill 0.61)
  Top 0.254: v50.16,6.35 U2.8 | v46.99,46.99 43.81,50.16 v40.16,50.16
  Bottom 0.254: v50.16,6.35 48.1,8.41 48.1,28.1 48.58,28.57 48.58,34.13 46.99,35.72 v46.99,46.99 | v40.16,50.16 35.56,54.77 N2.3 N2.8
N$1
  Top 0.254: LED1.C LED2.A
N$2
  Top 0.254: LED4.A 55.72,21.43 55.72,22.86 53.98,22.86 53.5,22.38 53.5,21.91 LED3.C
N$3
  Top 0.254: LED5.C LED6.A
N$4
  Top 0.254: LED8.A 70.96,21.43 70.96,22.86 69.22,22.86 68.74,22.38 68.74,21.91 LED7.C
N$5
  Top 0.254: LED11.C 83.98,21.75 83.98,20.32 85.72,20.32 86.2,20.8 86.2,21.27 LED12.A
N$6
  Top 0.254: LED9.C LED10.A
N$7
  Top 0.254: LED14.7 LED14.6
N$8
  Top 0.254: LED14.3 LED14.2
N$9
  Bottom 0.254: LED15.7 LED15.6
N$10
  Bottom 0.254: LED15.3 LED15.2
N$11
  Bottom 0.254: LED16.7 LED16.6
N$12
  Bottom 0.254: LED16.3 LED16.2
N$14  (via drill 0.61)
  Top 0.254: LED13.7 9.37,24.92 v14.45,24.92
  Bottom 0.254: LED13.1 v14.45,24.92
N$15
  Top 0.254: LED13.6 11.43,30.48 LED13.4
N$16
  Bottom 0.254: LED14.1 3.81,57.47 R1.2
N$17
  Bottom 0.254: LED14.5 5.56,67.15 5.56,53.82 R2.2
N$18  (via drill 0.61)
  Top 0.254: v12.54,36.51 12.86,36.83 R7.2
  Bottom 0.254: LED13.8 11.59,25.56 11.59,35.56 v12.54,36.51
N$19  (via drill 0.61)
  Top 0.254: R3.1 v28.73,54.61
  Bottom 0.254: LED15.1 28.73,55.4 v28.73,54.61
N$20
  Bottom 0.254: LED15.5 29.37,64.93 29.37,55.24 31.75,52.86 R4.2
N$21  (via drill 0.61)
  Top 0.254: LED13.5 10.48,32.07 v15.72,32.07
  Bottom 0.254: v15.72,32.07 17.78,34.13 R8.1
N$22
  Bottom 0.254: LED16.5 27.15,29.05 27.15,33.34 26.67,33.81 26.67,34.77 28.42,36.51 28.42,39.05 31.11,41.75 32.54,41.75 32.54,38.89 R5.2
N$23  (via drill 0.61)
  Top 0.254: LED16.1 26.51,18.26 v28.57,18.26
  Bottom 0.254: v28.57,18.26 28.89,18.57 28.89,38.1 R6.2
N$24  (via drill 0.61)
  Top 0.254: v7.62,5.87 13.18,5.87 14.61,4.45 U1.1
  Bottom 0.254: v7.62,5.87 6.19,7.3 6.19,33.18 JP5.2
N$25  (via drill 0.61)
  Top 0.254: v13.49,13.49 U1.24 | v14.45,16.67 24.61,16.67 25.56,15.72 25.56,14.92 25.4,14.76 25.4,11.91 27.62,11.91 27.94,12.22 27.94,14.76 28.1,14.92 29.69,14.92 30.64,13.97 v36.51,13.97 | 37.62,4.45 v37.31,4.76 | 41.27,4.45 U2.1
  Top 0.305: 41.27,4.45 37.62,4.45
  Bottom 0.254: v13.49,13.49 14.45,14.45 v14.45,16.67 | v36.51,13.97 37.31,13.18 v37.31,4.76
N$27  (via drill 0.61)
  Top 0.254: v64.45,9.05 64.29,8.89 42.07,8.89 40.32,10.64 37.62,10.64 37.62,13.02 38.42,13.81 40.96,13.81 U2.24 | v65.88,5.24 66.36,4.76 67.63,4.76 67.94,4.45 U3.1
  Bottom 0.254: v64.45,9.05 65.88,7.62 v65.88,5.24
N$28  (via drill 0.61)
  Top 0.254: 75.41,8.1 82.87,8.1 83.5,8.73 86.04,8.73 86.68,8.1 86.68,6.19 83.5,6.19 81.92,4.6 U3.12 | 75.41,8.1 62.23,8.1 60.64,6.51 57.31,6.51 55.24,4.45 U2.12 | U1.12 28.57,2.38 v21.91,2.38 | v75.41,9.37 75.41,8.1 | v76.99,71.28 76.68,70.96 27.62,70.96 26.35,69.69 8.41,69.69 5.56,66.83 5.56,51.59 v5.4,51.59
  Bottom 0.254: v21.91,2.38 20.95,1.43 5.71,1.43 5.71,28.73 1.91,32.54 1.91,36.2 1.98,36.27 | JP5.3 1.98,36.27 | v75.41,9.37 77.47,11.43 77.47,62.07 76.99,62.55 v76.99,71.28 | v5.4,51.59 1.91,48.1 1.91,36.35 1.98,36.27
N$29  (via drill 0.61)
  Top 0.254: U2.13 55.24,13.34 57.31,11.27 61.44,11.27 61.91,10.79 79.85,10.79 81.92,12.86 U3.13 82.55,14.13 88.11,14.13 v94.14,20.16 | U1.13 28.57,11.59 28.73,11.59 29.37,10.95 29.37,9.68 v22.86,9.68 | v22.07,26.04 18.26,29.84 18.26,33.02 JP5.1 1.91,33.02 1.91,43.66 11.43,53.18 13.97,53.18 16.51,55.72 33.34,55.72 36.04,53.02 90.81,53.02 v93.98,49.85
  Bottom 0.254: v22.86,9.68 22.07,10.48 v22.07,26.04 | v94.14,20.16 94.46,20.48 94.46,49.37 v93.98,49.85
N$31  (via drill 0.61)
  Top 0.254: U3.24 67.94,16.67 70.33,16.67 71.28,17.62 71.28,19.21 71.91,19.21 v75.56,22.86 | v76.04,41.43 73.5,43.97 51.91,43.97 50.96,43.02 6.19,43.02 JP5.4
  Bottom 0.254: v75.56,22.86 76.04,23.34 76.04,31.59 75.09,32.54 75.09,34.13 76.04,35.08 v76.04,41.43
N$34
  Top 0.254: U1.18 22.23,16.19 15.24,16.19 13.49,14.45 11.91,14.45 R9.1
N$35
  Top 0.254: U2.18 48.9,14.92 47.15,14.92 46.99,14.76 46.99,11.11 43.81,11.11 43.5,10.79 42.7,10.79 41.59,11.91 39.53,11.91 R10.1
N$36  (via drill 0.61)
  Top 0.254: U3.18 75.56,11.75 v76.2,11.75 | v68.1,9.37 v73.82,9.37
  Bottom 0.254: v73.82,9.37 v76.2,11.75 | v68.1,9.37 67.79,9.68 67.79,12.54 66.36,13.97 R11.1
N$37
  Top 0.254: LED13.3 LED13.2
  Bottom 0.254: SJ1.2 SJ1.1 10.16,43.18 | 10.16,43.18 JP5.5 | LED13.3 14.76,29.69 14.76,37.78 16.35,39.37 16.35,45.24 15.56,46.04 10.16,46.04 10.16,43.18
P0  (via drill 0.61)
  Top 0.254: U3.5 73.03,6.19 v73.5,6.19 | v77.95,62.87 77.47,63.34 30.16,63.34 26.04,59.21 v23.97,59.21 | R3.2 R4.1
  Bottom 0.254: P1.8 P1.3 15.4,67.15 15.4,57.94 16.35,56.99 21.59,56.99 21.67,56.91 | v73.5,6.19 77.95,10.64 v77.95,62.87 | 21.67,56.91 21.59,56.83 R3.2 | 21.67,56.91 v23.97,59.21
P1  (via drill 0.61)
  Top 0.254: U3.8 76.83,6.19 v76.52,6.19 | v68.42,41.12 66.52,43.02 v62.71,43.02 | v61.59,50.32 60.8,51.12 36.51,51.12 36.04,50.64 15.4,50.64 R2.1 | P2.3 P2.8
  Bottom 0.254: v76.52,6.19 74.45,4.13 69.06,4.13 69.06,16.99 68.42,17.62 v68.42,41.12 | v62.71,43.02 61.59,44.13 v61.59,50.32 | R2.1 R1.1 P2.3
R1.1  (via drill 0.61)
  Top 0.254: U1.2 15.88,5.4 v15.24,6.03 | v21.59,8.26 v17.46,8.26 13.97,8.26 v4.76,17.46
  Bottom 0.254: R1D1.3 R1D1.8 53.18,77.63 4.29,77.63 4.29,77.15 1.43,74.3 1.43,20.8 v4.76,17.46 | v17.46,8.26 v15.24,6.03 | v21.59,8.26 21.75,8.1 21.75,6.03 25.24,2.54 JP4.1
R1.2  (via drill 0.61)
  Top 0.254: U1.11 27.3,7.14 v29.37,7.14 | v38.73,23.97 38.73,24.45 39.37,25.08 v39.37,26.99 | v37.15,29.84 v39.53,29.84 | v34.61,57.15 34.77,57.31 38.58,57.31 39.53,58.26 39.53,59.05 39.69,59.05 40.16,59.53 53.5,59.53 R1D2.3
  Bottom 0.254: v29.37,7.14 31.43,5.08 JP4.2 34.61,7.94 34.61,13.34 37.94,16.67 39.21,16.67 39.21,23.5 v38.73,23.97 | R1D2.8 R1D2.3 | v39.37,26.99 39.53,27.15 v39.53,29.84 | v37.15,29.84 36.67,30.32 36.67,52.86 34.61,54.93 v34.61,57.15
R1.3  (via drill 0.61)
  Top 0.254: U1.6 20.95,2.38 v20.48,2.38 | v14.29,9.21 22.07,9.21 22.54,8.73 25.56,8.73 26.04,9.21 29.69,9.21 29.84,9.37 29.84,11.43 v30.16,11.43 | v53.5,40.16 52.55,39.21 12.7,39.21 11.59,38.1 11.59,35.24 v12.54,35.24
  Bottom 0.254: R1D3.8 R1D3.3 53.66,47.31 53.66,46.35 53.5,46.2 v53.5,40.16 | v20.48,2.38 14.61,2.38 14.61,5.4 14.29,5.71 v14.29,9.21 14.29,10.48 12.54,12.22 v12.54,35.24 | v30.16,11.43 33.66,11.43 33.66,9.53 JP4.3
R1.4  (via drill 0.61)
  Top 0.254: U1.7 22.23,6.35 v22.7,6.35 | R1D4.8 53.34,44.45 51.59,44.45 51.28,44.13 30,44.13 28.26,45.88 v23.18,45.88
  Bottom 0.254: R1D4.8 R1D4.3 | v22.7,6.35 23.65,5.4 26.67,5.4 | 26.67,5.4 28.42,5.4 28.42,7.46 31.11,10.16 JP4.4 | v23.18,45.88 23.02,45.72 23.02,33.97 24.13,32.86 24.13,26.35 24.92,25.56 24.92,25.08 26.04,23.97 27.15,23.97 27.15,16.51 26.67,16.03 26.67,5.4
R1.5  (via drill 0.61)
  Top 0.254: U1.3 17.14,6.03 v16.51,6.03 | v20.16,29.37 32.07,29.37 33.5,30.8 v43.5,30.8 50.48,30.8 50.96,31.27 v54.13,31.27 | v34.61,22.86 34.77,23.02 v43.5,23.02
  Bottom 0.254: v16.51,6.03 20.64,10.16 20.64,28.89 v20.16,29.37 | R1D5.3 54.61,30.8 v54.13,31.27 54.29,31.27 54.29,35.24 R1D5.8 | JP4.5 34.13,15.08 34.13,22.38 v34.61,22.86 | v43.5,30.8 v43.5,23.02
R1.S  (via drill 0.61)
  Top 0.254: SIGN1.8 55.72,24.29 57.15,24.29 57.15,21.27 LED4.C | SIGN1.3 54.61,18.89 | 54.61,18.89 LED2.C | U1.10 26.04,2.86 27.78,2.86 27.94,3.02 27.94,6.19 34.61,6.19 36.35,7.94 v42.7,7.94 | v45.56,15.88 48.58,18.89 54.61,18.89
  Bottom 0.254: v42.7,7.94 45.56,10.79 v45.56,15.88 | SIGN1.3 SIGN1.8
R2.1  (via drill 0.61)
  Top 0.254: U2.2 42.55,2.38 v43.02,2.38 | v76.52,45.72 83.98,38.26 83.98,36.67 90.65,36.67 91.6,35.72 91.6,27.15 90.96,27.15 90.33,26.51 82.07,26.51 81.12,25.56 v81.12,23.5 | v62.07,2.22 61.75,2.54 JP3.1
  Bottom 0.254: R2D1.3 R2D1.8 71.28,77.63 76.04,77.63 76.04,68.26 76.52,67.79 v76.52,45.72 | v43.02,2.38 43.97,1.43 53.34,1.43 53.34,2.7 53.98,3.33 58.42,3.33 JP3.1 | v81.12,23.5 78.42,20.8 78.42,6.83 74.93,3.33 68.26,3.33 68.26,2.38 68.1,2.22 v62.07,2.22
R2.2  (via drill 0.61)
  Top 0.254: U2.11 53.98,6.03 v54.61,6.03 | JP3.2 58.58,5.24 v63.82,5.24 | v63.18,58.42 64.29,59.53 68.74,59.53 R2D2.3
  Bottom 0.254: v54.61,6.03 58.42,6.03 JP3.2 | R2D2.8 R2D2.3 | v63.82,5.24 64.29,4.76 64.29,3.49 65.09,2.7 67.79,2.7 67.79,7.62 63.98,11.43 63.98,16.99 63.5,17.46 63.5,38.73 63.66,38.89 63.66,44.45 63.18,44.93 v63.18,58.42
R2.3  (via drill 0.61)
  Top 0.254: 47.62,8.1 47.62,8.26 57.78,8.26 JP3.3 | 47.62,8.1 U2.6 | R2D3.3 68.74,49.37 49.05,49.37 47.94,48.26 47.94,46.04 35.4,46.04 34.61,46.83 v22.38,46.83 | v34.13,3.17 35.88,4.92 36.2,4.92 38.26,6.99 44.93,6.99 46.04,8.1 47.62,8.1
  Bottom 0.254: R2D3.8 R2D3.3 | v22.38,46.83 19.84,44.29 19.84,33.02 21.11,31.75 21.11,9.05 20.64,8.57 20.64,6.35 25.56,1.43 34.13,1.43 v34.13,3.17
R2.4  (via drill 0.61)
  Top 0.254: U2.7 48.9,7.3 v55.56,7.3 | R2D4.3 68.74,39.21 v62.71,39.21 | v63.5,9.84 63.18,10.16 JP3.4
  Bottom 0.254: R2D4.8 R2D4.3 | JP3.4 v55.56,7.3 | v62.71,39.21 63.02,38.89 63.02,33.18 62.71,32.86 62.71,15.88 63.5,15.08 v63.5,9.84
R2.5  (via drill 0.61)
  Top 0.254: U2.3 43.81,2.86 v44.29,2.38 | R2D5.3 68.74,29.05 64.29,29.05 61.12,25.88 v61.12,18.41
  Bottom 0.254: R2D5.8 R2D5.3 | v44.29,2.38 52.86,2.38 52.86,3.02 53.82,3.97 60.33,3.97 60.33,10.79 JP3.5 58.58,12.7 60.8,14.92 60.8,18.1 v61.12,18.41
R2.S  (via drill 0.61)
  Top 0.254: SIGN2.3 LED6.C 69.85,19.68 70.96,19.68 72.39,21.11 LED8.C | v52.7,6.35 U2.10 | v50.96,30 51.28,30.32 v71.12,30.32
  Bottom 0.254: v52.7,6.35 51.59,7.46 51.59,16.67 50.96,17.3 v50.96,30 | v71.12,30.32 70.96,30.16 70.96,26.51 SIGN2.8 SIGN2.3
R3.1  (via drill 0.61)
  Top 0.254: R3D1.8 R3D1.3 | U3.2 69.22,2.38 v69.53,2.38 | v93.19,14.92 88.11,9.84 v88.11,5.87
  Bottom 0.254: v69.53,2.38 84.77,2.38 JP2.1 v88.11,5.87 | R3D1.8 93.03,68.26 93.03,15.08 v93.19,14.92
R3.2
  Top 0.254: U3.11 80.64,2.86 82.55,2.86 JP2.2
  Bottom 0.254: R3D2.3 R3D2.8 85.09,66.83 86.2,67.94 86.2,69.69 90.65,69.69 91.76,68.58 91.76,17.78 91.12,17.14 91.12,11.43 JP2.2
R3.3  (via drill 0.61)
  Top 0.254: U3.6 74.3,5.71 75.09,6.51 75.09,7.62 JP2.3 | R3D3.3 86.52,46.83 90.65,46.83 95.09,42.39 95.09,15.88 92.87,15.88 v88.11,11.11
  Bottom 0.254: R3D3.8 R3D3.3 | v88.11,11.11 84.77,7.78 JP2.3
R3.4  (via drill 0.61)
  Top 0.254: R3D4.8 85.09,39.21 | 85.09,39.21 R3D4.3 | U3.7 75.56,7.14 80.8,7.14 v81.28,6.67 | 85.09,39.21 90.65,39.21 92.08,37.78 92.08,22.38 v87.15,22.38
  Bottom 0.254: v81.28,6.67 JP2.4 86.68,12.06 86.68,15.72 86.52,15.88 86.52,21.75 v87.15,22.38
R3.5  (via drill 0.61)
  Top 0.254: U3.3 70.48,1.43 86.04,1.43 87.15,2.54 87.15,12.7 | JP2.5 87.15,12.7 | v88.74,13.49 87.95,12.7 87.15,12.7
  Bottom 0.254: R3D5.8 R3D5.3 86.52,26.51 86.52,24.29 88.74,22.07 v88.74,13.49
R3.S  (via drill 0.61)
  Top 0.254: SIGN3.3 85.09,18.89 | 85.09,18.89 LED10.C 85.09,19.68 86.2,19.68 87.63,21.11 LED12.C | v79.38,6.19 U3.10 | v79.85,16.19 80.33,16.67 80.49,16.67 81.44,17.62 81.44,18.89 85.09,18.89
  Bottom 0.254: v79.38,6.19 79.85,6.67 v79.85,16.19 | SIGN3.3 SIGN3.8
V0  (via drill 0.61)
  Top 0.254: U1.5 19.68,2.86 v13.65,2.86 | v12.54,37.78 12.86,38.1 R5.1 22.7,36.99 34.13,36.99 V1.8
  Bottom 0.254: V1.8 V1.3 | v13.65,2.86 12.54,3.97 12.54,11.43 10.16,13.81 10.16,19.53 7.14,22.54 7.14,32.38 v12.54,37.78 | R6.1 21.59,40.32 R5.1
V1  (via drill 0.61)
  Top 0.254: R7.1 R8.2 16.35,34.29 17.46,35.4 v20.8,35.4 | U1.8 23.5,5.87 v23.97,6.35 | v23.65,25.24 24.92,26.51 34.45,26.51 V2.8
  Bottom 0.254: v23.97,6.35 23.81,6.51 23.81,14.92 23.65,15.08 v23.65,25.24 23.65,32.54 v20.8,35.4 | V2.8 V2.3

### Text on the board
Top: NASADWG15122901-RIGEL | AGC MINI-DSKY
Bottom: SBOTTS SAN DIEGO CAL, USA
tPlace: +
bPlace: DP1 | DP2 | DP3 | R1.5 | R2.5 | R3.5 | R1.4 | R2.4 | R3.4 | R1.3 | R2.3 | R3.3 | R1.2 | R2.2 | R3.2 | R1.1 | R2.1 | R3.1
bValues: AT | DO | LD | DI | CLK
tStop: NASADWG15122901-RIGEL | AGC MINI-DSKY
bStop: SBOTTS SAN DIEGO CAL, USA